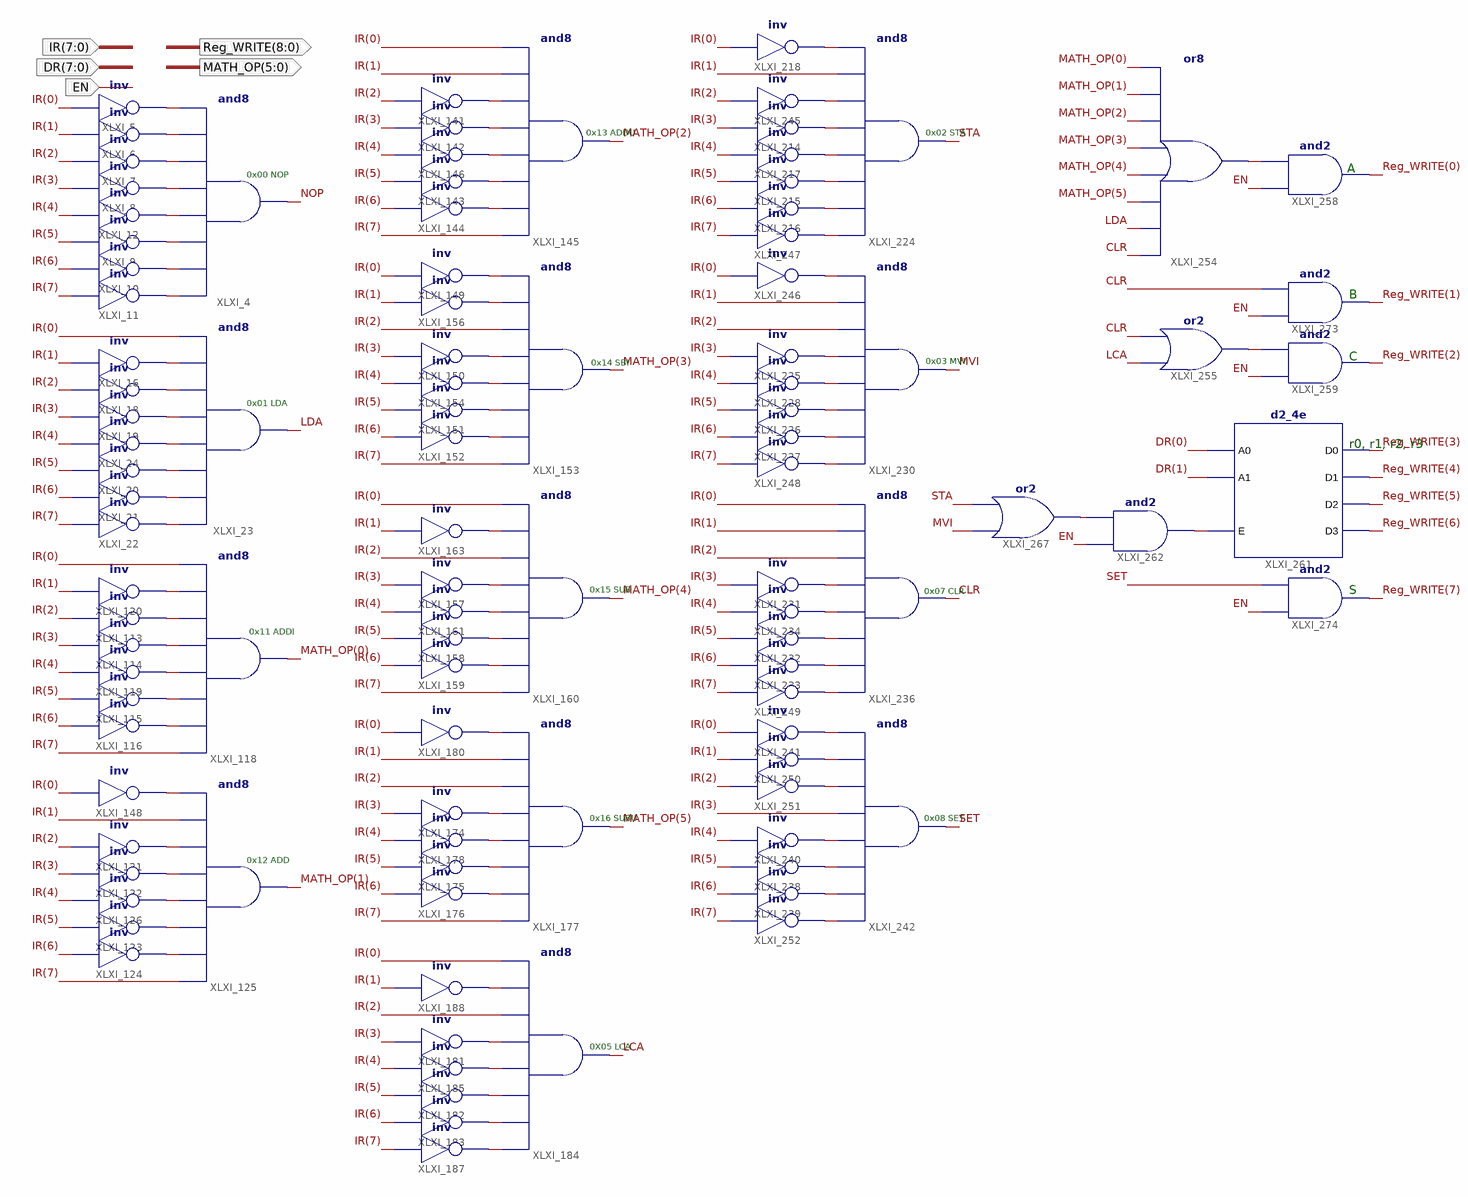
[diagram p0: schematic sheet 1]
// Xilinx ISE schematic CU_Write.sch (spartan3e) as structural Verilog: 101 symbols, 5 ports
module CU_Write (
  input  [7:0] IR,
  input  [7:0] DR,
  input  EN,
  output [8:0] Reg_WRITE,
  output [5:0] MATH_OP
);

  wire CLR, LCA, LDA, MVI, NOP, SET, STA, XLXN_3, XLXN_4, XLXN_5, XLXN_6, XLXN_7, XLXN_8, XLXN_9, XLXN_17,
       XLXN_26, XLXN_27, XLXN_28, XLXN_29, XLXN_30, XLXN_33, XLXN_201, XLXN_202, XLXN_203, XLXN_204,
       XLXN_206, XLXN_217, XLXN_218, XLXN_224, XLXN_225, XLXN_226, XLXN_227, XLXN_228, XLXN_252, XLXN_253,
       XLXN_254, XLXN_255, XLXN_256, XLXN_266, XLXN_268, XLXN_269, XLXN_270, XLXN_272, XLXN_289, XLXN_290,
       XLXN_292, XLXN_293, XLXN_294, XLXN_295, XLXN_306, XLXN_322, XLXN_323, XLXN_324, XLXN_325, XLXN_337,
       XLXN_338, XLXN_339, XLXN_340, XLXN_341, XLXN_352, XLXN_354, XLXN_399, XLXN_400, XLXN_401, XLXN_402,
       XLXN_411, XLXN_428, XLXN_429, XLXN_430, XLXN_431, XLXN_442, XLXN_443, XLXN_444, XLXN_445, XLXN_456,
       XLXN_457, XLXN_459, XLXN_467, XLXN_476, XLXN_477, XLXN_480, XLXN_482, XLXN_484, XLXN_486, XLXN_488,
       XLXN_490, XLXN_501, XLXN_502, XLXN_516, XLXN_522;

  not XLXI_5 (XLXN_3, IR[0]);
  not XLXI_6 (XLXN_4, IR[1]);
  not XLXI_7 (XLXN_5, IR[2]);
  not XLXI_8 (XLXN_6, IR[3]);
  not XLXI_9 (XLXN_7, IR[5]);
  not XLXI_10 (XLXN_8, IR[6]);
  not XLXI_11 (XLXN_9, IR[7]);
  not XLXI_12 (XLXN_17, IR[4]);
  not XLXI_18 (XLXN_30, IR[2]);
  not XLXI_19 (XLXN_29, IR[3]);
  not XLXI_20 (XLXN_28, IR[5]);
  not XLXI_21 (XLXN_27, IR[6]);
  not XLXI_22 (XLXN_26, IR[7]);
  and XLXI_23 (LDA, XLXN_26, XLXN_27, XLXN_28, XLXN_33, XLXN_29, XLXN_30, XLXN_217, IR[0]);
  not XLXI_24 (XLXN_33, IR[4]);
  and XLXI_4 (NOP, XLXN_9, XLXN_8, XLXN_7, XLXN_17, XLXN_6, XLXN_5, XLXN_4, XLXN_3);
  not XLXI_113 (XLXN_204, IR[2]);
  not XLXI_114 (XLXN_203, IR[3]);
  not XLXI_115 (XLXN_202, IR[5]);
  not XLXI_116 (XLXN_201, IR[6]);
  and XLXI_118 (MATH_OP[0], IR[7], XLXN_201, XLXN_202, XLXN_206, XLXN_203, XLXN_204, XLXN_218, IR[0]);
  not XLXI_119 (XLXN_206, IR[4]);
  not XLXI_16 (XLXN_217, IR[1]);
  not XLXI_120 (XLXN_218, IR[1]);
  not XLXI_121 (XLXN_227, IR[2]);
  not XLXI_122 (XLXN_226, IR[3]);
  not XLXI_123 (XLXN_225, IR[5]);
  not XLXI_124 (XLXN_224, IR[6]);
  and XLXI_125 (MATH_OP[1], IR[7], XLXN_224, XLXN_225, XLXN_228, XLXN_226, XLXN_227, IR[1], XLXN_266);
  not XLXI_126 (XLXN_228, IR[4]);
  and XLXI_145 (MATH_OP[2], IR[7], XLXN_252, XLXN_253, XLXN_256, XLXN_254, XLXN_255, IR[1], IR[0]);
  not XLXI_146 (XLXN_256, IR[4]);
  not XLXI_148 (XLXN_266, IR[0]);
  not XLXI_150 (XLXN_270, IR[3]);
  not XLXI_151 (XLXN_269, IR[5]);
  not XLXI_152 (XLXN_268, IR[6]);
  and XLXI_153 (MATH_OP[3], IR[7], XLXN_268, XLXN_269, XLXN_272, XLXN_270, IR[2], XLXN_290, XLXN_289);
  not XLXI_154 (XLXN_272, IR[4]);
  not XLXI_157 (XLXN_294, IR[3]);
  not XLXI_158 (XLXN_293, IR[5]);
  not XLXI_159 (XLXN_292, IR[6]);
  and XLXI_160 (MATH_OP[4], IR[7], XLXN_292, XLXN_293, XLXN_295, XLXN_294, IR[2], XLXN_306, IR[0]);
  not XLXI_161 (XLXN_295, IR[4]);
  not XLXI_163 (XLXN_306, IR[1]);
  not XLXI_174 (XLXN_324, IR[3]);
  not XLXI_175 (XLXN_323, IR[5]);
  not XLXI_176 (XLXN_322, IR[6]);
  and XLXI_177 (MATH_OP[5], IR[7], XLXN_322, XLXN_323, XLXN_325, XLXN_324, IR[2], IR[1], XLXN_337);
  not XLXI_178 (XLXN_325, IR[4]);
  not XLXI_180 (XLXN_337, IR[0]);
  not XLXI_181 (XLXN_340, IR[3]);
  not XLXI_182 (XLXN_339, IR[5]);
  not XLXI_183 (XLXN_338, IR[6]);
  and XLXI_184 (LCA, XLXN_352, XLXN_338, XLXN_339, XLXN_341, XLXN_340, IR[2], XLXN_354, IR[0]);
  not XLXI_185 (XLXN_341, IR[4]);
  not XLXI_187 (XLXN_352, IR[7]);
  not XLXI_188 (XLXN_354, IR[1]);
  not XLXI_156 (XLXN_290, IR[1]);
  not XLXI_149 (XLXN_289, IR[0]);
  not XLXI_144 (XLXN_252, IR[6]);
  not XLXI_143 (XLXN_253, IR[5]);
  not XLXI_142 (XLXN_254, IR[3]);
  not XLXI_141 (XLXN_255, IR[2]);
  not XLXI_214 (XLXN_401, IR[3]);
  not XLXI_215 (XLXN_400, IR[5]);
  not XLXI_216 (XLXN_399, IR[6]);
  not XLXI_217 (XLXN_402, IR[4]);
  and XLXI_224 (STA, XLXN_480, XLXN_399, XLXN_400, XLXN_402, XLXN_401, XLXN_476, IR[1], XLXN_411);
  not XLXI_225 (XLXN_430, IR[3]);
  not XLXI_226 (XLXN_429, IR[5]);
  not XLXI_227 (XLXN_428, IR[6]);
  not XLXI_228 (XLXN_431, IR[4]);
  and XLXI_230 (MVI, XLXN_482, XLXN_428, XLXN_429, XLXN_431, XLXN_430, IR[2], IR[1], XLXN_477);
  not XLXI_231 (XLXN_444, IR[3]);
  not XLXI_232 (XLXN_443, IR[5]);
  not XLXI_233 (XLXN_442, IR[6]);
  not XLXI_234 (XLXN_445, IR[4]);
  and XLXI_236 (CLR, XLXN_484, XLXN_442, XLXN_443, XLXN_445, XLXN_444, IR[2], IR[1], IR[0]);
  not XLXI_238 (XLXN_457, IR[5]);
  not XLXI_239 (XLXN_456, IR[6]);
  not XLXI_240 (XLXN_459, IR[4]);
  not XLXI_241 (XLXN_467, IR[0]);
  and XLXI_242 (SET, XLXN_490, XLXN_456, XLXN_457, XLXN_459, IR[3], XLXN_488, XLXN_486, XLXN_467);
  not XLXI_218 (XLXN_411, IR[0]);
  not XLXI_245 (XLXN_476, IR[2]);
  not XLXI_246 (XLXN_477, IR[0]);
  not XLXI_247 (XLXN_480, IR[7]);
  not XLXI_248 (XLXN_482, IR[7]);
  not XLXI_249 (XLXN_484, IR[7]);
  not XLXI_250 (XLXN_486, IR[1]);
  not XLXI_251 (XLXN_488, IR[2]);
  not XLXI_252 (XLXN_490, IR[7]);
  or XLXI_254 (XLXN_501, CLR, LDA, MATH_OP[5], MATH_OP[4], MATH_OP[3], MATH_OP[2], MATH_OP[1], MATH_OP[0]);
  and XLXI_258 (Reg_WRITE[0], EN, XLXN_501);
  d2_4e XLXI_261 (
    .A0(DR[0]), .A1(DR[1]), .E(XLXN_516), .D0(Reg_WRITE[3]), .D1(Reg_WRITE[4]), .D2(Reg_WRITE[5]),
    .D3(Reg_WRITE[6]));
  and XLXI_262 (XLXN_516, EN, XLXN_522);
  or XLXI_255 (XLXN_502, LCA, CLR);
  and XLXI_259 (Reg_WRITE[2], EN, XLXN_502);
  or XLXI_267 (XLXN_522, MVI, STA);
  and XLXI_274 (Reg_WRITE[7], EN, SET);
  and XLXI_273 (Reg_WRITE[1], EN, CLR);

  // Notes on the sheet:
  //   0x13 ADDU
  //   0x02 STA
  //   A
  //   0x00 NOP
  //   B
  //   C
  //   0x03 MVI
  //   0x14 SBI
  //   0x01 LDA
  //   r0, r1, r2, r3
  //   0x15 SUB
  //   S
  //   0x07 CLR
  //   0x11 ADDI
  //   0x16 SUBU
  //   0x08 SET
  //   0x12 ADD
  //   0X05 LCA
endmodule
